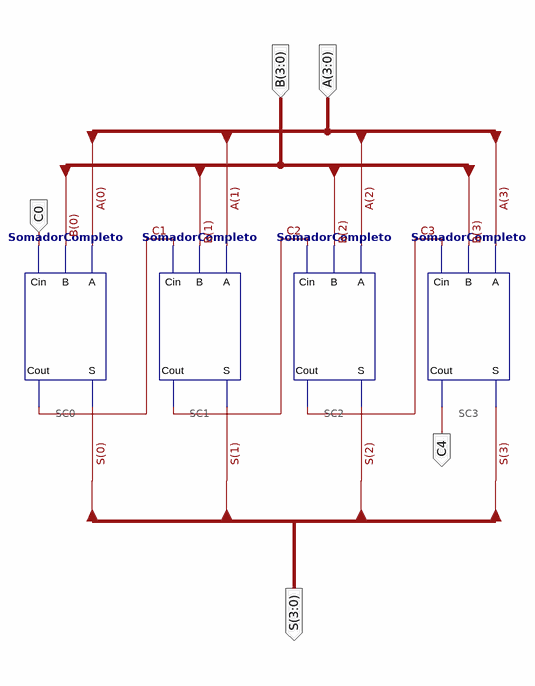
[diagram p0: schematic sheet 1]
// Xilinx ISE schematic SomadorQuatroBits.sch (spartan3e) as structural Verilog: 4 symbols, 5 ports
module SomadorQuatroBits (
  input  C0,
  input  [3:0] A,
  input  [3:0] B,
  output C4,
  output [3:0] S
);

  wire C1, C2, C3;

  SomadorCompleto SC0 (.A(A[0]), .B(B[0]), .Cin(C0), .S(S[0]), .Cout(C1));
  SomadorCompleto SC1 (.A(A[1]), .B(B[1]), .Cin(C1), .S(S[1]), .Cout(C2));
  SomadorCompleto SC2 (.A(A[2]), .B(B[2]), .Cin(C2), .S(S[2]), .Cout(C3));
  SomadorCompleto SC3 (.A(A[3]), .B(B[3]), .Cin(C3), .S(S[3]), .Cout(C4));
endmodule
